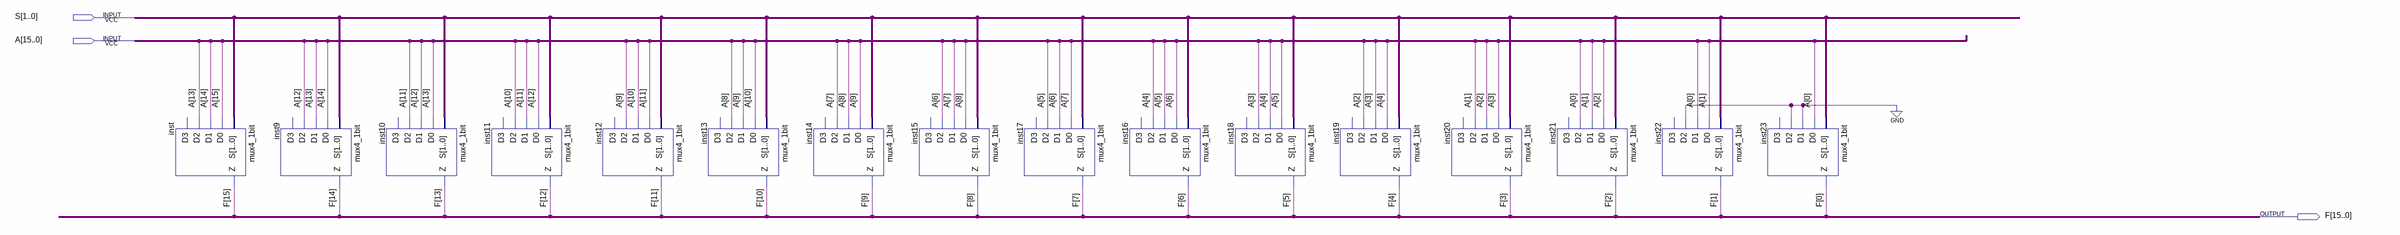
[diagram p0: schematic sheet]
// Quartus schematic barrel_shift.bdf as structural Verilog: 16 symbols, 3 pins
module barrel_shift (
  input  [1:0] S,
  input  [15:0] A,
  output [15:0] F
);

  mux4_1bit inst (.S(S), .D0(A[15]), .D1(A[14]), .D2(A[13]), .Z(F[15]));  // open: D3
  mux4_1bit inst9 (.S(S), .D0(A[14]), .D1(A[13]), .D2(A[12]), .Z(F[14]));  // open: D3
  mux4_1bit inst10 (.S(S), .D0(A[13]), .D1(A[12]), .D2(A[11]), .Z(F[13]));  // open: D3
  mux4_1bit inst11 (.S(S), .D0(A[12]), .D1(A[11]), .D2(A[10]), .Z(F[12]));  // open: D3
  mux4_1bit inst12 (.S(S), .D0(A[11]), .D1(A[10]), .D2(A[9]), .Z(F[11]));  // open: D3
  mux4_1bit inst13 (.S(S), .D0(A[10]), .D1(A[9]), .D2(A[8]), .Z(F[10]));  // open: D3
  mux4_1bit inst14 (.S(S), .D0(A[9]), .D1(A[8]), .D2(A[7]), .Z(F[9]));  // open: D3
  mux4_1bit inst15 (.S(S), .D0(A[8]), .D1(A[7]), .D2(A[6]), .Z(F[8]));  // open: D3
  mux4_1bit inst17 (.S(S), .D0(A[7]), .D1(A[6]), .D2(A[5]), .Z(F[7]));  // open: D3
  mux4_1bit inst16 (.S(S), .D0(A[6]), .D1(A[5]), .D2(A[4]), .Z(F[6]));  // open: D3
  mux4_1bit inst18 (.S(S), .D0(A[5]), .D1(A[4]), .D2(A[3]), .Z(F[5]));  // open: D3
  mux4_1bit inst19 (.S(S), .D0(A[4]), .D1(A[3]), .D2(A[2]), .Z(F[4]));  // open: D3
  mux4_1bit inst20 (.S(S), .D0(A[3]), .D1(A[2]), .D2(A[1]), .Z(F[3]));  // open: D3
  mux4_1bit inst21 (.S(S), .D0(A[2]), .D1(A[1]), .D2(A[0]), .Z(F[2]));  // open: D3
  mux4_1bit inst22 (.S(S), .D0(A[1]), .D1(A[0]), .D2(1'b0), .Z(F[1]));  // open: D3
  mux4_1bit inst23 (.S(S), .D0(A[0]), .D1(1'b0), .D2(1'b0), .Z(F[0]));  // open: D3
endmodule
